# EAGLE schematic psupply2 (EAGLE 6.5.0)
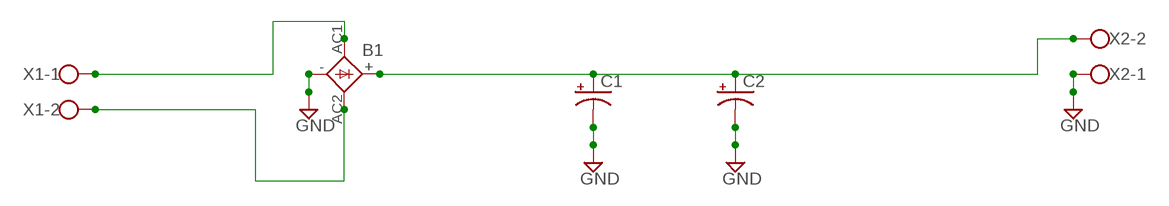
[diagram p0: schematic, sheet 1]

## Parts
B1  GBPC80X  [GBPC80X]
C1  CPOL-USE5-4  [E5-4]
C2  CPOL-USE7.5-18  [E7,5-18]
X1  W237-102  [W237-102]
X2  W237-102  [W237-102]

## Nets
GND: B1.- C1.- C2.- X2.1
N$1: B1.AC1 X1.1
N$2: B1.AC2 X1.2
N$3: B1.+ C1.+ C2.+ X2.2

## Library data of the parts
B1 = rectifier:GBPC80X: GENERAL INSTRUMENT RECTIFIER
C1 C2 = rcl:CPOL-US: POLARIZED CAPACITOR, American symbol
X1 X2 = con-wago-500:W237-102: WAGO SCREW CLAMP; MPN: 237-102; OC_FARNELL: unknown; OC_NEWARK: 70K9898